# EAGLE design lpcdev (EAGLE 7.5.0)
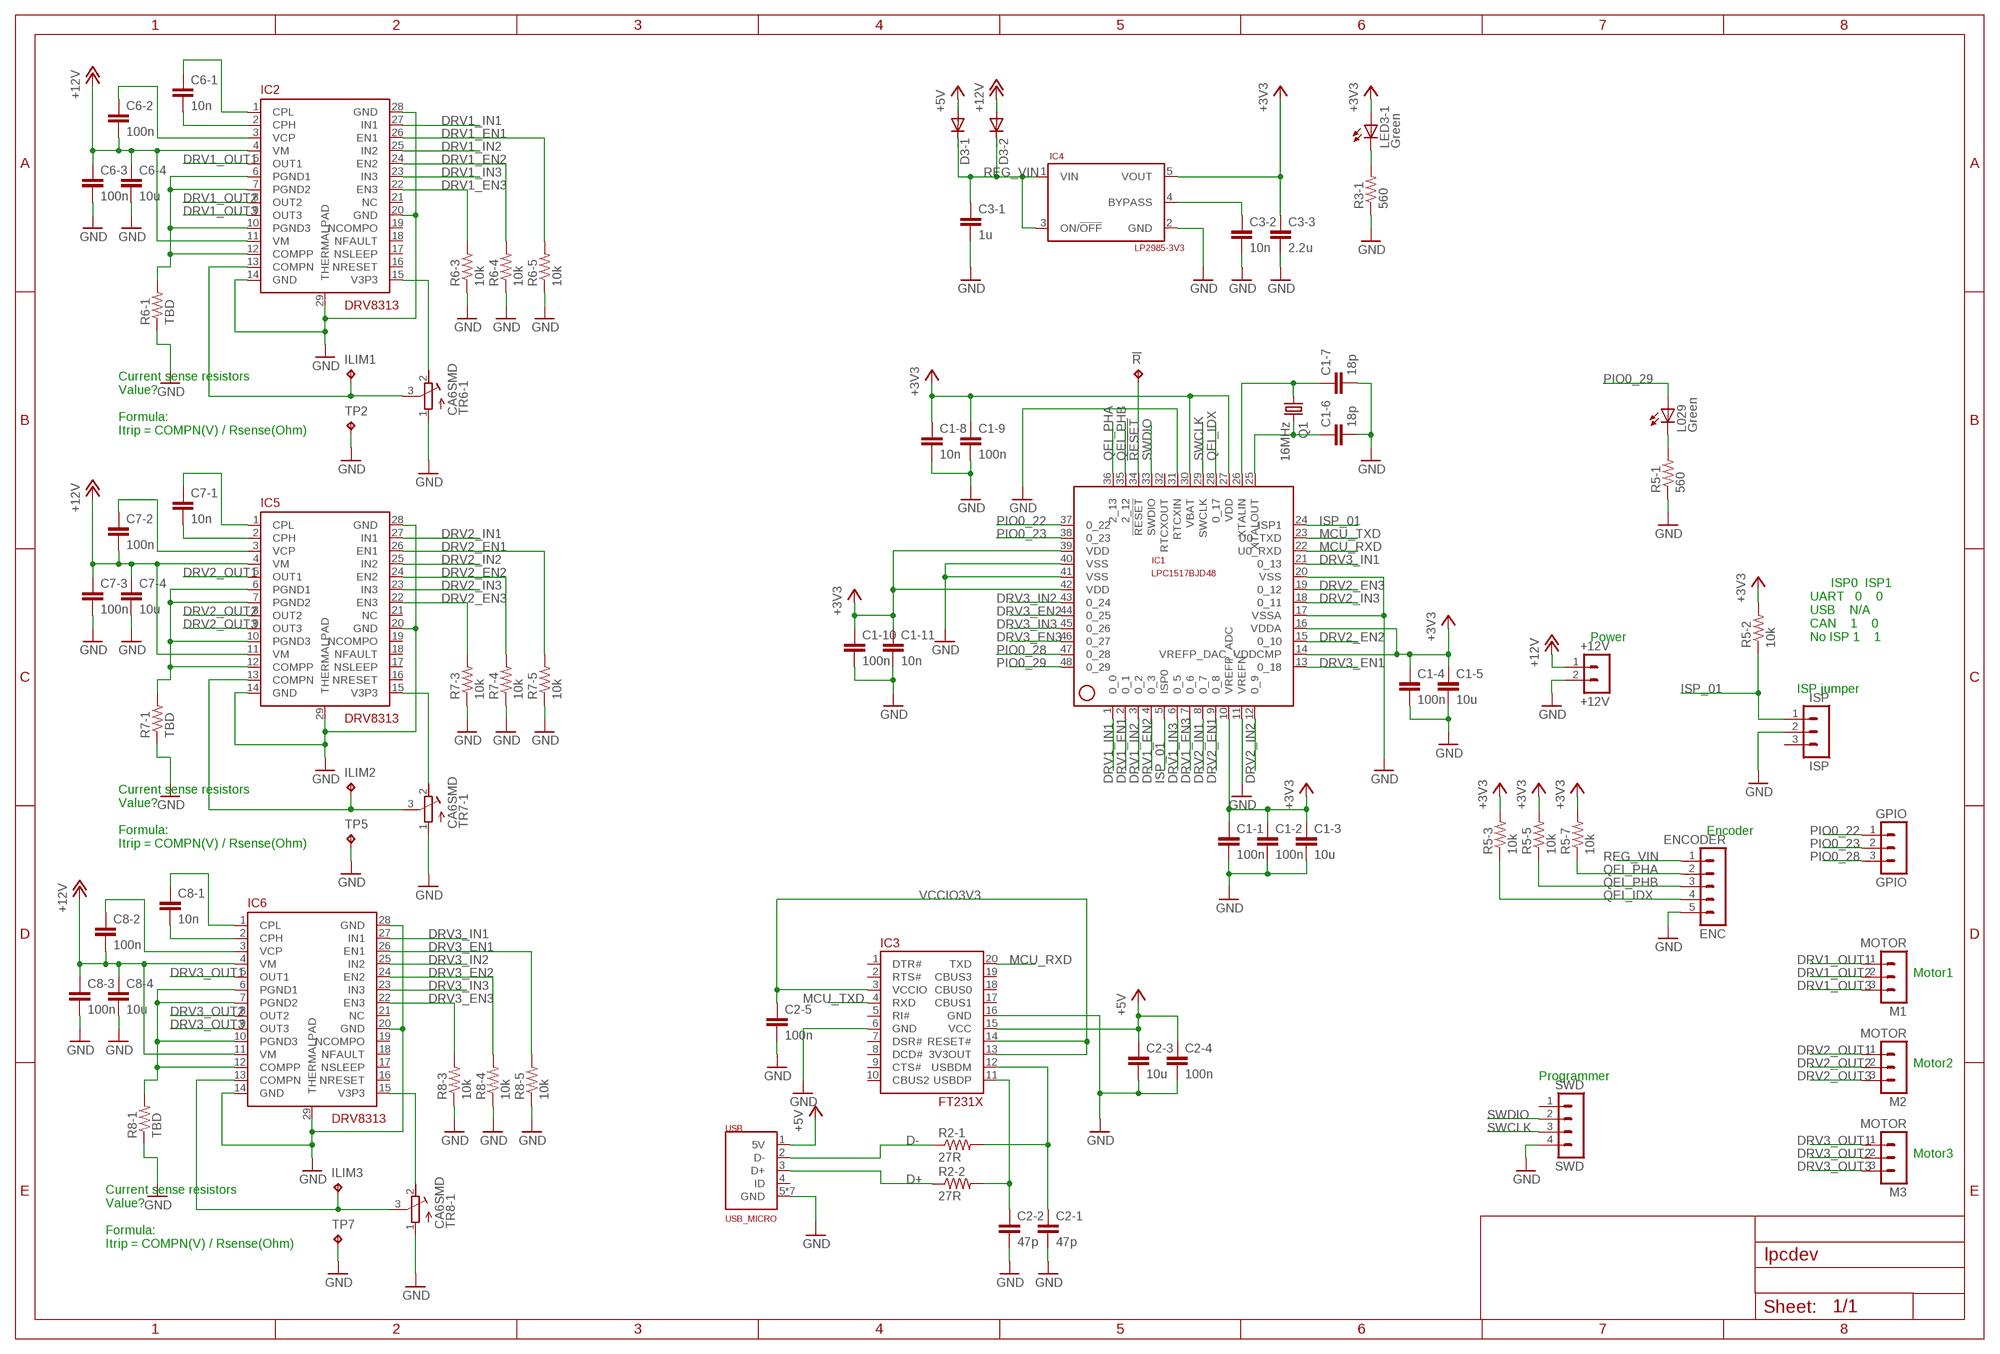
[diagram p0: schematic, sheet 1]

## Parts
!R  TPB1,27  [B1,27]
+12V  +12V  MA02-1  [MA02-1]
C1-1  100n  C-EUC0603  [C0603]
C1-2  100n  C-EUC0603  [C0603]
C1-3  10u  C-EUC0805  [C0805]
C1-4  100n  C-EUC0603  [C0603]
C1-5  10u  C-EUC0805  [C0805]
C1-6  18p  C-EUC0603  [C0603]
C1-7  18p  C-EUC0603  [C0603]
C1-8  10n  C-EUC0603  [C0603]
C1-9  100n  C-EUC0603  [C0603]
C1-10  100n  C-EUC0603  [C0603]
C1-11  10n  C-EUC0603  [C0603]
C2-1  47p  C-EUC0603  [C0603]
C2-2  47p  C-EUC0603  [C0603]
C2-3  10u  C-EUC0805  [C0805]
C2-4  100n  C-EUC0603  [C0603]
C2-5  100n  C-EUC0603  [C0603]
C3-1  1u  C-EUC0805  [C0805]
C3-2  10n  C-EUC0603  [C0603]
C3-3  2.2u  C-EUC0805  [C0805]
C6-1  10n  C-EUC0603  [C0603]
C6-2  100n  C-EUC0603  [C0603]
C6-3  100n  C-EUC0603  [C0603]
C6-4  10u  C-EUC0805  [C0805]
C7-1  10n  C-EUC0603  [C0603]
C7-2  100n  C-EUC0603  [C0603]
C7-3  100n  C-EUC0603  [C0603]
C7-4  10u  C-EUC0805  [C0805]
C8-1  10n  C-EUC0603  [C0603]
C8-2  100n  C-EUC0603  [C0603]
C8-3  100n  C-EUC0603  [C0603]
C8-4  10u  C-EUC0805  [C0805]
D3-1  DIODE-SOD323-R  [SOD323-R]
D3-2  DIODE-SOD323-R  [SOD323-R]
ENC  ENCODER  MA05-1  [MA05-1]
GPIO  GPIO  MA03-1  [MA03-1]
IC1  LPC1517BJD48  [LQFP48]
IC2  DRV8313  [R-PDSO-G28]
IC3  FT231X  [SSOP-20]
IC4  LP2985-3V3  [SOT23]
IC5  DRV8313  [R-PDSO-G28]
IC6  DRV8313  [R-PDSO-G28]
ILIM1  TPB1,27  [B1,27]
ILIM2  TPB1,27  [B1,27]
ILIM3  TPB1,27  [B1,27]
ISP  ISP  MA03-1  [MA03-1]
L029  Green  LEDCHIP-LED0603  [CHIP-LED0603]
LED3-1  Green  LEDCHIP-LED0603  [CHIP-LED0603]
M1  MOTOR  MA03-1  [MA03-1]
M2  MOTOR  MA03-1  [MA03-1]
M3  MOTOR  MA03-1  [MA03-1]
Q1  16MHz  CRYSTALCTS406  [CTS406]
R2-1  27R  R-US_R0603  [R0603]
R2-2  27R  R-US_R0603  [R0603]
R3-1  560  R-US_R0603  [R0603]
R5-1  560  R-US_R0603  [R0603]
R5-2  10k  R-US_R0603  [R0603]
R5-3  10k  R-US_R0603  [R0603]
R5-5  10k  R-US_R0603  [R0603]
R5-7  10k  R-US_R0603  [R0603]
R6-1  TBD  R-US_R0805  [R0805]
R6-3  10k  R-US_R0603  [R0603]
R6-4  10k  R-US_R0603  [R0603]
R6-5  10k  R-US_R0603  [R0603]
R7-1  TBD  R-US_R0805  [R0805]
R7-3  10k  R-US_R0603  [R0603]
R7-4  10k  R-US_R0603  [R0603]
R7-5  10k  R-US_R0603  [R0603]
R8-1  TBD  R-US_R0805  [R0805]
R8-3  10k  R-US_R0603  [R0603]
R8-4  10k  R-US_R0603  [R0603]
R8-5  10k  R-US_R0603  [R0603]
SWD  SWD  MA04-1  [MA04-1]
TP2  TPB1,27  [B1,27]
TP5  TPB1,27  [B1,27]
TP7  TPB1,27  [B1,27]
TR6-1  CA6SMD  [CA6SMD]
TR7-1  CA6SMD  [CA6SMD]
TR8-1  CA6SMD  [CA6SMD]
USB  USB_MICRO  [USB_MICRO]

## Nets
!RESET: !R.TP IC1.34(!RESET)
+3V3: C1-1.1 C1-2.1 C1-3.1 C1-4.1 C1-5.1 C1-8.1 C1-9.1 C1-10.1 C1-11.1 C3-3.1 IC1.10(VREFP_ADC) IC1.14(VREFP_DAC_VDDCMP) IC1.16(VDDA) IC1.27(VDD) IC1.30(VBAT) IC1.39(VDD) IC1.42(VDD) IC4.5(VOUT) LED3-1.A R5-2.2 R5-3.2 R5-5.2 R5-7.2
+5V: C2-3.1 C2-4.1 D3-1.A IC3.15(VCC) USB.1(5V)
+12V: +12V.1 C6-2.2 C6-3.1 C6-4.1 C7-2.2 C7-3.1 C7-4.1 C8-2.2 C8-3.1 C8-4.1 D3-2.A IC2.4(VM) IC2.11(VM) IC5.4(VM) IC5.11(VM) IC6.4(VM) IC6.11(VM)
D+: R2-2.1 USB.3(D+)
D-: R2-1.1 USB.2(D-)
DRV1_3V3: IC2.15(V3P3) TR6-1.2(E)
DRV1_COMPN: IC2.13(COMPN) ILIM1.TP TR6-1.3(S)
DRV1_COMPP: IC2.6(PGND1) IC2.7(PGND2) IC2.10(PGND3) IC2.12(COMPP) R6-1.2
DRV1_CPH: C6-1.2 IC2.2(CPH)
DRV1_CPL: C6-1.1 IC2.1(CPL)
DRV1_EN1: IC1.2(0_1) IC2.26(EN1) R6-5.2
DRV1_EN2: IC1.4(0_3) IC2.24(EN2) R6-4.2
DRV1_EN3: IC1.7(0_6) IC2.22(EN3) R6-3.2
DRV1_IN1: IC1.1(0_0) IC2.27(IN1)
DRV1_IN2: IC1.3(0_2) IC2.25(IN2)
DRV1_IN3: IC1.6(0_5) IC2.23(IN3)
DRV1_OUT1: IC2.5(OUT1) M1.1
DRV1_OUT2: IC2.8(OUT2) M1.2
DRV1_OUT3: IC2.9(OUT3) M1.3
DRV1_VCP: C6-2.1 IC2.3(VCP)
DRV2_3V1: IC5.15(V3P3) TR7-1.2(E)
DRV2_COMPN1: IC5.13(COMPN) ILIM2.TP TR7-1.3(S)
DRV2_COMPP1: IC5.6(PGND1) IC5.7(PGND2) IC5.10(PGND3) IC5.12(COMPP) R7-1.2
DRV2_CPH1: C7-1.2 IC5.2(CPH)
DRV2_CPL1: C7-1.1 IC5.1(CPL)
DRV2_EN1: IC1.9(0_8) IC5.26(EN1) R7-5.2
DRV2_EN2: IC1.15(0_10) IC5.24(EN2) R7-4.2
DRV2_EN3: IC1.19(0_12) IC5.22(EN3) R7-3.2
DRV2_IN1: IC1.8(0_7) IC5.27(IN1)
DRV2_IN2: IC1.12(0_9) IC5.25(IN2)
DRV2_IN3: IC1.18(0_11) IC5.23(IN3)
DRV2_OUT1: IC5.5(OUT1) M2.1
DRV2_OUT2: IC5.8(OUT2) M2.2
DRV2_OUT3: IC5.9(OUT3) M2.3
DRV2_VCP1: C7-2.1 IC5.3(VCP)
DRV3_3V2: IC6.15(V3P3) TR8-1.2(E)
DRV3_COMPN2: IC6.13(COMPN) ILIM3.TP TR8-1.3(S)
DRV3_COMPP2: IC6.6(PGND1) IC6.7(PGND2) IC6.10(PGND3) IC6.12(COMPP) R8-1.2
DRV3_CPH2: C8-1.2 IC6.2(CPH)
DRV3_CPL2: C8-1.1 IC6.1(CPL)
DRV3_EN1: IC1.13(0_18) IC6.26(EN1) R8-5.2
DRV3_EN2: IC1.44(0_25) IC6.24(EN2) R8-4.2
DRV3_EN3: IC1.46(0_27) IC6.22(EN3) R8-3.2
DRV3_IN1: IC1.21(0_13) IC6.27(IN1)
DRV3_IN2: IC1.43(0_24) IC6.25(IN2)
DRV3_IN3: IC1.45(0_26) IC6.23(IN3)
DRV3_OUT1: IC6.5(OUT1) M3.1
DRV3_OUT2: IC6.8(OUT2) M3.2
DRV3_OUT3: IC6.9(OUT3) M3.3
DRV3_VCP2: C8-2.1 IC6.3(VCP)
GND: +12V.2 C1-1.2 C1-2.2 C1-3.2 C1-4.2 C1-5.2 C1-6.2 C1-7.2 C1-8.2 C1-9.2 C1-10.2 C1-11.2 C2-1.2 C2-2.2 C2-3.2 C2-4.2 C2-5.2 C3-1.2 C3-2.2 C3-3.2 C6-3.2 C6-4.2 C7-3.2 C7-4.2 C8-3.2 C8-4.2 ENC.5 IC1.11(VREFN) IC1.17(VSSA) IC1.20(VSS) IC1.31(RTCXIN) IC1.40(VSS) IC1.41(VSS) IC2.14(GND) IC2.20(GND) IC2.28(GND) IC2.29(THERMALPAD) IC3.6(GND) IC3.16(GND) IC4.2(GND) IC5.14(GND) IC5.20(GND) IC5.28(GND) IC5.29(THERMALPAD) IC6.14(GND) IC6.20(GND) IC6.28(GND) IC6.29(THERMALPAD) ISP.2 R3-1.1 R5-1.1 R6-1.1 R6-3.1 R6-4.1 R6-5.1 R7-1.1 R7-3.1 R7-4.1 R7-5.1 R8-1.1 R8-3.1 R8-4.1 R8-5.1 SWD.4 TP2.TP TP5.TP TP7.TP TR6-1.1(A) TR7-1.1(A) TR8-1.1(A) USB.5(GND) USB.H1(GND) USB.H2(GND) USB.S1(GND) USB.S2(GND) USB.S3(GND) USB.S4(GND)
ISP_01: IC1.5(ISP0) IC1.24(ISP1) ISP.1 R5-2.1
LED1: L029.C R5-1.2
LED2: LED3-1.C R3-1.2
MCU_RXD: IC1.22(U0_RXD) IC3.20(TXD)
MCU_TXD: IC1.23(U0_TXD) IC3.4(RXD)
PIO0_22: GPIO.1 IC1.37(0_22)
PIO0_23: GPIO.2 IC1.38(0_23)
PIO0_28: GPIO.3 IC1.47(0_28)
PIO0_29: IC1.48(0_29) L029.A
QEI_IDX: ENC.4 IC1.28(0_17) R5-3.1
QEI_PHA: ENC.2 IC1.36(2_13) R5-7.1
QEI_PHB: ENC.3 IC1.35(2_12) R5-5.1
REG_BYPASS: C3-2.1 IC4.4(BYPASS)
REG_VIN: C3-1.1 D3-1.C D3-2.C ENC.1 IC4.1(VIN) IC4.3(ON/!OFF)
SWCLK: IC1.29(SWCLK) SWD.3
SWDIO: IC1.33(SWDIO) SWD.2
USBDM: C2-1.1 IC3.12(USBDM) R2-1.2
USBDP: C2-2.1 IC3.11(USBDP) R2-2.2
VCCIO3V3: C2-5.1 IC3.3(VCCIO) IC3.13(3V3OUT) IC3.14(RESET#)
XTALIN: C1-7.1 IC1.26(XTALIN) Q1.1
XTALOUT: C1-6.1 IC1.25(XTALOUT) Q1.3
Unconnected: IC1.32(RTCXOUT) IC2.16(NRESET) IC2.17(NSLEEP) IC2.18(NFAULT) IC2.19(NCOMPO) IC2.21(NC) IC3.1(DTR#) IC3.2(RTS#) IC3.5(RI#) IC3.7(DSR#) IC3.8(DCD#) IC3.9(CTS#) IC3.10(CBUS2) IC3.17(CBUS1) IC3.18(CBUS0) IC3.19(CBUS3) IC5.16(NRESET) IC5.17(NSLEEP) IC5.18(NFAULT) IC5.19(NCOMPO) IC5.21(NC) IC6.16(NRESET) IC6.17(NSLEEP) IC6.18(NFAULT) IC6.19(NCOMPO) IC6.21(NC) ISP.3 SWD.1 USB.4(ID)

## Notes on the sheet
- Current sense resistors
  Value?
  
  Formula:
  Itrip = COMPN(V) / Rsense(Ohm)
- Power
- ISP0  ISP1
  UART   0    0
  USB    N/A
  CAN    1    0
  No ISP 1    1
- ISP jumper
- Encoder
- Current sense resistors
  Value?
  
  Formula:
  Itrip = COMPN(V) / Rsense(Ohm)
- Motor1
- Motor2
- Programmer
- Motor3
- Current sense resistors
  Value?
  
  Formula:
  Itrip = COMPN(V) / Rsense(Ohm)

## Library data of the parts
!R ILIM1-ILIM3 TP2 TP5 TP7 = testpad:TP: Test pad
+12V = lpclib:MA02-1: PIN HEADER; OC_FARNELL: unknown; OC_NEWARK: unknown
C1-1-C1-11 C2-1-C2-5 C3-1-C3-3 C6-1-C6-4 C7-1-C7-4 C8-1-C8-4 = rcl:C-EU: CAPACITOR, European symbol
D3-1 D3-2 = diode:DIODE-: DIODE
ENC = lpclib:MA05-1: PIN HEADER; OC_FARNELL: unknown; OC_NEWARK: unknown
GPIO ISP M1-M3 = lpclib:MA03-1: PIN HEADER; OC_FARNELL: unknown; OC_NEWARK: unknown
IC1 = lpclib:LPC1517BJD48: LPC1517BJD48 First try at a LPC1517 chip for use in a motor driver Datasheet <http://www.nxp.com/documents/data_sheet/LPC15XX.pdf> User manual <http://www.nxp.com/documents/user_manual/UM10736.pdf>
IC2 IC5 IC6 = lpclib:DRV8313: DRV8313 Datasheet <http://www.ti.com/lit/ds/symlink/drv8313.pdf>
IC3 = lpclib:FT231X: FT231X Datasheet <http://www.ftdichip.com/Support/Documents/DataSheets/ICs/DS_FT231X.pdf>
IC4 = lpclib:LP2985-3V3: LP2985 3.3V regulator Datasheet <http://www.electrokit.com/productFile/download/940>
L029 LED3-1 = led:LED: LED OSRAM: - CHIPLED LG R971, LG N971, LY N971, LG Q971, LY Q971, LO R971, LY R971 LH N974, LH R974 LS Q976, LO Q976, LY Q976 LO Q996 - Hyper CHIPLED LW Q18S LB Q993, LB Q99A, LB R99A - SideLED LS A670, LO A670, LY A670, LG A670, LP A670 LB A673, LV A673, LT A673, LW A673 LH A674 LY A675 LS A676, LA A676, LO A676, LY A676, LW A676 LS A679, LY A679, LG A679 - Hyper Micro SIDELED® LS Y876, LA Y876, LO Y876, LY Y876 LT Y87S - SmartLED LW L88C, LW L88S LB L89C, LB L89S, LG L890 LS L89K, LO L89K, LY L89K LS L896, LA L896, LO L896, LY L896 - TOPLED LS T670, LO T670, LY T670, LG T670, LP T670 LSG T670, LSP T670, LSY T670, LOP T670, LYG T670 LG T671, LOG T671, LSG T671 LB T673, LV T673, LT T673, LW T673 LH T674 LS T676, LA T676, LO T676, LY T676, LB T676, LH T676, LSB T676, LW T676 LB T67C, LV T67C, LT T67C, LS T67K, LO T67K, LY T67K, LW E67C LS E67B, LA E67B, LO E67B, LY E67B, LB E67C, LV E67C, LT E67C LW T67C LS T679, LY T679, LG T679 LS T770, LO T770, LY T770, LG T770, LP T770 LB T773, LV T773, LT T773, LW T773 LH T774 LS E675, LA E675, LY E675, LS T675 LS T776, LA T776, LO T776, LY T776, LB T776 LHGB T686 LT T68C, LB T68C - Hyper Mini TOPLED® LB M676 - Mini TOPLED Santana® LG M470 LS M47K, LO M47K, LY M47K Source: http://www.osram.convergy.de LUXEON: - LUMILED® LXK2-PW12-R00, LXK2-PW12-S00, LXK2-PW14-U00, LXK2-PW14-V00 LXK2-PM12-R00, LXK2-PM12-S00, LXK2-PM14-U00 LXK2-PE12-Q00, LXK2-PE12-R00, LXK2-PE12-S00, LXK2-PE14-T00, LXK2-PE14-U00 LXK2-PB12-K00, LXK2-PB12-L00, LXK2-PB12-M00, LXK2-PB14-N00, LXK2-PB14-P00, LXK2-PB14-Q00 LXK2-PR12-L00, LXK2-PR12-M00, LXK2-PR14-Q00, LXK2-PR14-R00 LXK2-PD12-Q00, LXK2-PD12-R00, LXK2-PD12-S00 LXK2-PH12-R00, LXK2-PH12-S00 LXK2-PL12-P00, LXK2-PL12-Q00, LXK2-PL12-R00 Source: www.luxeon.com KINGBRIGHT: KA-3528ASYC Source: www.kingbright.com
Q1 = crystal:CRYSTAL: CRYSTAL; OC_FARNELL: unknown; OC_NEWARK: unknown
R2-1 R2-2 R3-1 R5-1-R5-3 R5-5 R5-7 R6-1 R6-3-R6-5 R7-1 R7-3-R7-5 R8-1 R8-3-R8-5 = rcl:R-US_: RESISTOR, American symbol
SWD = lpclib:MA04-1: PIN HEADER; OC_FARNELL: unknown; OC_NEWARK: unknown
TR6-1 TR7-1 TR8-1 = lpclib:CA6SMD: Electrokit <http://www.electrokit.com/trimpot-ca6smd-10-kohm.51062>
USB = lpclib:USB_MICRO: Electrokit <http://www.electrokit.com/usb-microb-kontakt-smd.50116>

## Board
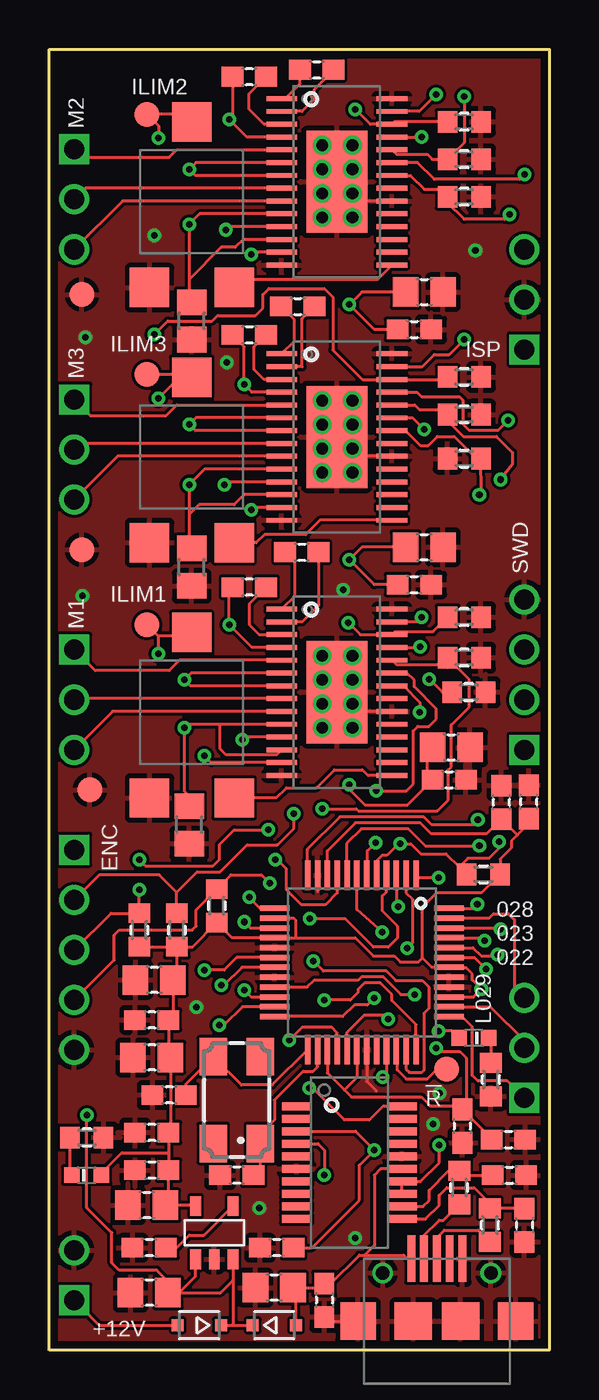
[diagram p1: board, top side]
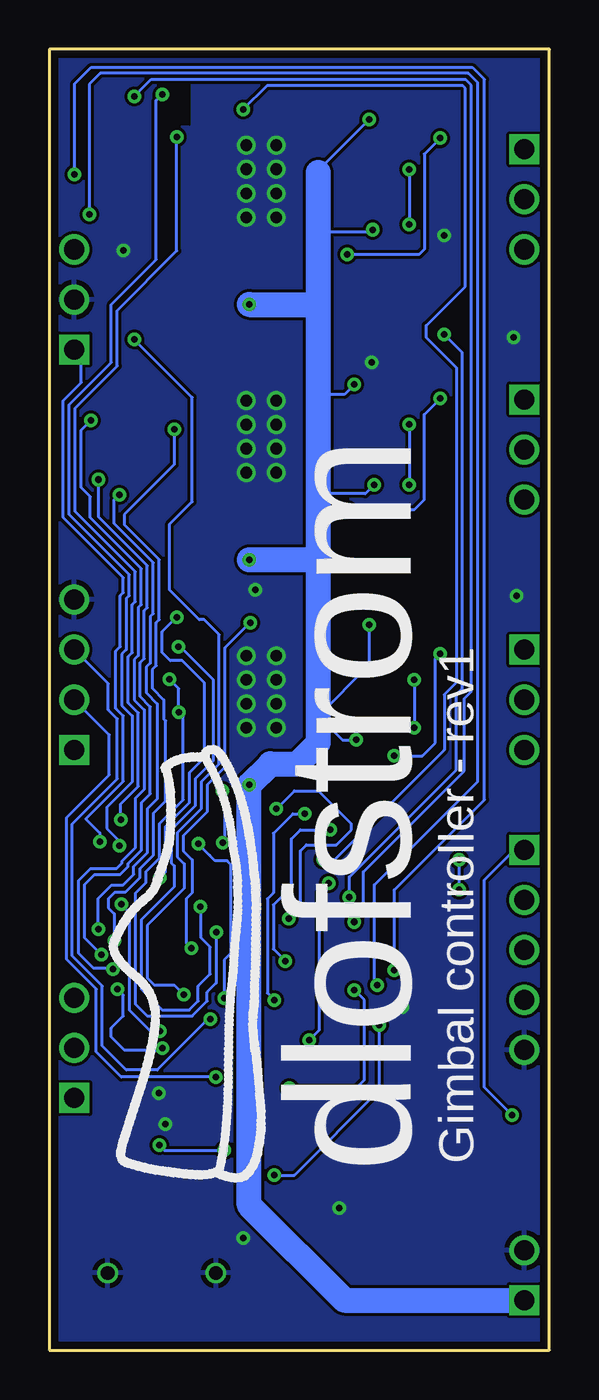
[diagram p2: board, bottom side, seen from below]

Size 25.4 x 66.04 mm. Coordinates in mm from the lower left corner, seen from the top.
Outline: 0,66.04 25.4,66.04 25.4,0 0,0 0,66.04
Copper layers (1*16): Top 0.0356mm / dielectric 1.5011mm / Bottom 0.0356mm
Design rules "oshpark-2layer *": minimum track width 6mil, minimum drill 13mil, track to track 6mil, track to pad 6mil, pad to pad 6mil, via to via 6mil, smd to smd 6mil, copper to edge 15mil, drill to drill 6mil, minimum pad ring 7mil, minimum via ring 7mil, stop-mask expansion 2.5mil, vias tented up to drill 13mil, thermal gap 10mil
bRestrict: area 18.3,62.2 to 18.7,64.2

### Footprints (pad centres in the part's own frame; a part is rotated, then mirrored left to right if it is on the bottom)
B1,27 = smd 1.27 x 1.27: TP 0,0
MA02-1 = drill 1.016 square: 1 -2.54,0 | drill 1.016: 2 0,0
C0603 = smd 1.1 x 1: 1 -0.85,0; 2 0.85,0
C0805 = smd 1.3 x 1.5: 1 -0.95,0; 2 0.95,0
SOD323-R = smd 0.6 x 0.6: A 1.1,0; C -1.1,0
MA05-1 = drill 1.016 square: 1 -5.08,0 | drill 1.016: 2 -2.54,0; 3 0,0; 4 2.54,0; 5 5.08,0
MA03-1 = drill 1.016 square: 1 -2.54,0 | drill 1.016: 2 0,0; 3 2.54,0
LQFP48 = smd 0.28 x 1.5: 1 -2.75,-4.425; 2 -2.25,-4.425; 3 -1.75,-4.425; 4 -1.25,-4.425; 5 -0.75,-4.425; 6 -0.25,-4.425; 7 0.25,-4.425; 8 0.75,-4.425; 9 1.25,-4.425; 10 1.75,-4.425; 11 2.25,-4.425; 12 2.75,-4.425; 25 2.75,4.425; 26 2.25,4.425; 27 1.75,4.425; 28 1.25,4.425; 29 0.75,4.425; 30 0.25,4.425; 31 -0.25,4.425; 32 -0.75,4.425; 33 -1.25,4.425; 34 -1.75,4.425; 35 -2.25,4.425; 36 -2.75,4.425 | smd 1.5 x 0.28: 13 4.425,-2.75; 14 4.425,-2.25; 15 4.425,-1.75; 16 4.425,-1.25; 17 4.425,-0.75; 18 4.425,-0.25; 19 4.425,0.25; 20 4.425,0.75; 21 4.425,1.25; 22 4.425,1.75; 23 4.425,2.25; 24 4.425,2.75; 37 -4.425,2.75; 38 -4.425,2.25; 39 -4.425,1.75; 40 -4.425,1.25; 41 -4.425,0.75; 42 -4.425,0.25; 43 -4.425,-0.25; 44 -4.425,-0.75; 45 -4.425,-1.25; 46 -4.425,-1.75; 47 -4.425,-2.25; 48 -4.425,-2.75
R-PDSO-G28 = smd 0.25 x 1.55: 1 -4.225,-2.8; 2 -3.575,-2.8; 3 -2.925,-2.8; 4 -2.275,-2.8; 5 -1.625,-2.8; 6 -0.975,-2.8; 7 -0.325,-2.8; 8 0.325,-2.8; 9 0.975,-2.8; 10 1.625,-2.8; 11 2.275,-2.8; 12 2.925,-2.8; 13 3.575,-2.8; 14 4.225,-2.8; 15 4.225,2.8; 16 3.575,2.8; 17 2.925,2.8; 18 2.275,2.8; 19 1.625,2.8; 20 0.975,2.8; 21 0.325,2.8; 22 -0.325,2.8; 23 -0.975,2.8; 24 -1.625,2.8; 25 -2.275,2.8; 26 -2.925,2.8; 27 -3.575,2.8; 28 -4.225,2.8 | smd 5.18 x 3.1: 29 0,0
SSOP-20 = smd 0.4 x 1.5: 1 -2.857,-2.68; 2 -2.223,-2.68; 3 -1.587,-2.68; 4 -0.953,-2.68; 5 -0.318,-2.68; 6 0.318,-2.68; 7 0.953,-2.68; 8 1.587,-2.68; 9 2.223,-2.68; 10 2.857,-2.68; 11 2.857,2.68; 12 2.223,2.68; 13 1.587,2.68; 14 0.953,2.68; 15 0.318,2.68; 16 -0.318,2.68; 17 -0.953,2.68; 18 -1.587,2.68; 19 -2.223,2.68; 20 -2.857,2.68
SOT23 = smd 0.55 x 1: 1 -0.95,-1.35; 2 0,-1.35; 3 0.95,-1.35; 4 0.95,1.35; 5 -0.95,1.35
CHIP-LED0603 = smd 0.8 x 0.8: A 0,-0.75; C 0,0.75
CTS406 = smd 1.9 x 1.4: 1 -2.2,-1.2; 2 2.2,-1.2; 3 2.2,1.2; 4 -2.2,1.2
R0603 = smd 1 x 1.1: 1 -0.85,0; 2 0.85,0
R0805 = smd 1.3 x 1.5: 1 -0.95,0; 2 0.95,0
MA04-1 = drill 1.016 square: 1 -3.81,0 | drill 1.016: 2 -1.27,0; 3 1.27,0; 4 3.81,0
CA6SMD = smd 2 x 2: 1 -2.15,-4.35; 2 2.15,-4.35; 3 0,4.05
USB_MICRO = smd 0.4 x 2.35: 1 -1.3,3.175; 2 -0.65,3.175; 3 0,3.175; 4 0.65,3.175; 5 1.3,3.175 | drill 0.7: H1 -2.75,2.45; H2 2.75,2.45 | smd 1.8 x 1.9: S1 -4,0; S4 4,0 | smd 1.9 x 1.9: S2 -1.2,0; S3 1.2,0

### Placement (x,y rotation side)
!R  20.19,14.27 0 top
+12V  1.27,5.08 90 top
C1-1  22.96,27.81 90 top
C1-2  24.36,27.84 90 top
C1-3  5.33,18.8 180 top
C1-4  5.21,16.76 180 top
C1-5  5.21,14.86 180 top
C1-6  6.1,12.95 180 top
C1-7  9.53,8.89 180 top
C1-8  5.21,11.05 180 top
C1-9  5.21,9.14 180 top
C1-10  20.98,11.38 270 top
C1-11  23.32,10.69 0 top
C2-1  23.37,8.89 0 top
C2-2  24.13,6.35 270 top
C2-3  11.43,3.18 180 top
C2-4  13.97,2.54 270 top
C2-5  11.56,5.21 180 top
C3-1  5.08,2.92 180 top
C3-2  5.08,5.21 180 top
C3-3  4.95,7.37 180 top
C6-1  12.83,40.51 0 top
C6-2  10.16,38.73 180 top
C6-3  20.32,28.96 0 top
C6-4  20.42,30.61 0 top
C7-1  13.59,65 0 top
C7-2  10.16,64.64 180 top
C7-3  18.54,51.82 0 top
C7-4  19.05,53.72 0 top
C8-1  12.62,52.98 0 top
C8-2  10.16,51.54 180 top
C8-3  18.54,38.86 0 top
C8-4  19.05,40.77 0 top
D3-1  11.43,1.27 0 top
D3-2  7.62,1.27 180 top
ENC  1.27,20.32 270 top
GPIO  24.13,15.34 90 top
IC1  15.88,19.68 180 top
IC2  14.61,33.4 270 top
IC3  15.24,9.53 270 top
IC4  8.38,5.97 0 top
IC5  14.61,59.31 270 top
IC6  14.61,46.36 270 top
ILIM1  4.95,36.83 0 top
ILIM2  4.95,62.74 0 top
ILIM3  4.95,49.53 0 top
ISP  24.13,53.34 90 top
L029  21.56,15.85 270 top
LED3-1  1.91,8.89 90 top
M1  1.27,33.02 270 top
M2  1.27,58.42 270 top
M3  1.27,45.72 270 top
Q1  9.53,12.7 90 top
R2-1  20.83,8.26 90 top
R2-2  22.38,6.35 90 top
R3-1  1.91,10.79 180 top
R5-1  22.43,13.74 90 top
R5-2  22.05,24.16 0 top
R5-3  8.51,22.56 270 top
R5-5  4.57,21.34 270 top
R5-7  6.48,21.34 270 top
R6-1  7.11,26.67 90 top
R6-3  21.31,33.4 180 top
R6-4  21.08,35.15 180 top
R6-5  21.08,37.21 180 top
R7-1  7.24,52.25 90 top
R7-3  21.08,58.55 180 top
R7-4  21.08,60.45 180 top
R7-5  21.08,62.36 180 top
R8-1  7.24,39.75 90 top
R8-3  21.08,45.26 0 top
R8-4  21.08,47.5 180 top
R8-5  21.08,49.4 180 top
SWD  24.13,34.29 90 top
TP2  2.06,28.45 0 top
TP5  1.65,40.64 0 top
TP7  1.65,53.59 0 top
TR6-1  7.24,32.39 0 top
TR7-1  7.24,58.29 0 top
TR8-1  7.24,45.34 0 top
USB  19.68,1.47 0 top

### Tracks (layer width: path | path; a pad name or v marks a point on that pad's centre or on a via)
!RESET
  Top 0.152: IC1.34 17.68,15.21 17.68,14.22 18.14,13.77 19.2,13.77 19.71,14.27 !R.TP
+3V3  (via drill 0.33)
  Top 0.152: R5-5.2 R5-7.2 | R5-7.2 6.48,18.99 C1-3.1 6.28,16.99 C1-4.1 6.06,14.96 C1-5.1 6.16,11.15 C1-8.1 6.06,10.03 | 6.06,10.03 C1-9.1 6.06,7.52 C3-3.1 7.38,7.37 IC4.5 | LED3-1.A 2.65,9 3.68,10.03 6.06,10.03 | IC1.27 14.12,14.07 14.99,13.21 | 14.99,13.21 15.34,12.85 18.9,12.85 19.36,12.39 20.81,12.39 C1-10.1 | IC1.14 12.41,21.93 12.5,21.84 12.5,20.93 | 12.5,20.93 IC1.16 9.28,20.93 R5-3.2 7.29,20.49 R5-7.2 | IC1.10 14.12,25.35 15.54,26.77 18.85,26.77 19.41,26.21 22.21,26.21 C1-1.1 | 23.07,26.62 C1-1.1 | IC1.30 15.62,13.85 14.99,13.21 | 18.95,19.91 19.43,19.43 IC1.42 20.85,19.43 20.88,19.41 21.18,19.41 21.49,19.1 21.49,18.8 v21.95,18.34 21.54,17.93 IC1.39 | 12.5,20.93 15.54,20.93 16.46,20.01 17.53,20.01 17.83,19.71 18.75,19.71 18.95,19.91 | C1-2.1 24.34,26.55 24.18,26.55 23.77,26.15 | 23.77,26.15 C1-1.1 | 23.77,26.15 23.47,25.85 23.47,25.5 22.9,24.93 R5-2.2 21.96,23.22 19.66,23.22 18.95,22.5 18.95,19.91 | C1-10.1 22.47,10.74 C1-11.1 | C1-10.1 21.18,12.43 21.18,14.83 20.85,15.16 19.84,15.16 v19.66,15.34
  Bottom 0.152: v21.95,18.34 21.64,18.03 21.64,16.97 22.25,16.36 22.25,15.9 21.59,15.24 19.76,15.24 v19.66,15.34
+5V
  Top 0.152: D3-1.A 12.53,3.02 C2-3.1 13.76,3.17 C2-4.1 14.31,3.39 15.75,4.83 16,4.83 | 16,4.83 18,4.83 18.18,4.65 USB.1 | IC3.15 16.83,9.21 16.51,8.89 16.51,5.33 16,4.83
+12V  (via drill 0.33, 0.33 pad 0.33)
  Top 0.152: +12V.1 2.54,1.27 D3-2.A | IC6.4 10.3,48.63 v9.91,49.02 9.91,50.94 C8-2.2 9.31,51.4 | IC6.11 9.03,44.08 v8.89,43.94 | IC2.4 10.3,35.68 v9.14,36.83 9.14,38.57 C6-2.2 | IC5.4 10.04,61.58 v9.14,62.48 9.31,62.65 C7-2.2 | C7-4.1 15.88,53.72 v15.24,53.09 16.51,51.82 C7-3.1 | C8-4.1 15.88,40.77 v15.24,40.13 16.51,38.86 C8-3.1 | v15.24,28.7 15.24,28.47 16.03,27.69 18.2,27.69 C6-3.1 19.22,29.21 19.22,30.35 C6-4.1 | IC2.11 9.94,31.13 v9.8,30.99 | IC5.11 9.13,57.03 v8.98,56.88
  Bottom 0.152: v9.8,30.99 10.52,30.99 11.73,32.21 9.14,34.8 v9.14,36.83 | v8.89,43.94 9.35,43.48 11.73,43.48 | 11.91,53.09 arc90 11.73,52.91 | v9.91,49.02 10.41,48.51 11.73,48.51 | 11.73,56.74 9.12,56.74 v8.98,56.88 | 11.73,59.79 11.73,59.89 v9.14,62.48
  Bottom 1.27: +12V.1 10.41,2.54 15.24,7.37 v15.24,28.7 14.17,29.77 12.8,29.77 11.73,30.84 11.73,32.21 11.73,32.82 11.73,40.13 | 11.73,40.13 11.73,43.48 11.73,48.51 11.73,52.91 11.73,56.74 11.73,59.79 | v15.24,40.13 11.73,40.13 | v15.24,53.09 11.91,53.09
D+
  Top 0.152: USB.3 19.68,5.71 20.07,6.1 21.78,6.1 R2-2.1
D-
  Top 0.152: R2-1.1 20.03,6.6 19.81,6.6 19.04,5.83 USB.2
DRV1_3V3
  Top 0.152: TR6-1.2 11.53,28.03 12.04,28.55 13.56,28.55 14.48,29.46 15.9,29.46 16.19,29.18 IC2.15
DRV1_COMPN  (via drill 0.33 pad 0.33)
  Top 0.152: ILIM1.TP 5.54,36.25 | 5.54,36.25 v5.54,35.36 | TR6-1.3 7.05,36.25 5.54,36.25 | IC2.13 8.22,29.83 v7.87,30.17
  Bottom 0.152: v7.87,30.17 6.45,30.17 5.79,30.84 5.79,35.1 v5.54,35.36
DRV1_COMPP  (via drill 0.33 pad 0.33)
  Top 0.152: IC2.6 7.2,34.38 v6.86,34.04 7.17,33.73 IC2.7 | IC2.10 8.69,31.78 | 8.69,31.78 7.04,31.78 v6.86,31.6 6.86,28.38 7.11,28.13 R6-1.2 | IC2.12 11.55,30.23 8.99,30.23 8.69,30.53 8.69,31.78
  Bottom 0.152: v6.86,34.04 v6.86,31.6
DRV1_CPH
  Top 0.152: C6-1.2 13.68,37.81 12.85,36.98 IC2.2
DRV1_CPL
  Top 0.152: C6-1.1 12.45,40.04 12.45,38.27 IC2.1
DRV1_EN1  (via drill 0.33 pad 0.33)
  Top 0.152: IC1.2 18.12,23.23 18.44,22.91 18.44,20.68 v18.19,20.42 | v15.19,36.93 15.79,36.33 IC2.26 17.55,36.47 19.5,36.47 R6-5.2
  Bottom 0.152: v15.19,36.93 16.46,35.66 16.46,29.62 17.37,28.7 17.37,27.33 18.59,26.11 18.59,25.35 18.14,24.89 18.14,23.22 18.44,22.91 18.44,20.68 v18.19,20.42
DRV1_EN2  (via drill 0.33 pad 0.33)
  Top 0.152: IC1.4 17.12,23.27 16.92,23.06 16.92,22.3 17.68,21.54 17.68,20.93 17.22,20.47 16.46,20.47 15.04,21.9 v13.23,21.9 | v13.87,27.48 15.6,27.48 15.7,27.38 19.71,27.38 20.27,27.94 20.27,29.46 20.42,29.62 20.42,31.75 21.34,32.66 21.34,34.04 20.23,35.14 R6-4.2 | IC2.24 17.63,34.8 19.88,34.8 R6-4.2 | 20.57,34.81 R6-4.2 | 20.23,34.63 R6-4.2
  Bottom 0.152: v13.87,27.48 12.95,28.4 11.73,28.4 10.06,26.72 10.06,26.42 10.82,25.65 12.34,25.65 12.65,25.35 12.65,22.4 13.15,21.9 v13.23,21.9
DRV1_EN3  (via drill 0.33 pad 0.15, 0.33 pad 0.33)
  Top 0.152: IC1.7 15.62,22.37 v16.92,21.23 | IC2.22 17.98,33.73 18.82,32.89 v18.82,32.38 | v19.3,34.06 19.96,33.4 R6-3.2
  Bottom 0.152: v16.92,21.23 16.92,18.64 17.37,18.19 17.37,17.73 18.14,16.97 20.42,16.97 21.03,17.58 21.03,23.19 20.5,23.72 20.5,24.28 19.81,24.97 19.81,26.72 18.59,27.94 18.59,32.16 v18.82,32.38 18.82,33.58 v19.3,34.06
DRV1_IN1  (via drill 0.33 pad 0.33)
  Top 0.152: 18.64,24.13 IC1.1 18.76,23.98 v19.79,23.98 | v18.92,37.21 18.69,36.98 IC2.27
  Bottom 0.152: v18.92,37.21 19.66,36.47 19.66,35.41 19.25,35 18.64,35 17.53,33.88 17.53,30.07 18.29,29.31 18.29,27.79 19.51,26.57 19.51,24.26 v19.79,23.98
DRV1_IN2  (via drill 0.33 pad 0.33)
  Top 0.152: IC2.25 18.81,35.68 v18.85,35.71 | IC1.3 17.62,22.61 v17.73,22.5
  Bottom 0.152: v18.85,35.71 18.75,35.71 17.07,34.04 17.07,29.92 17.98,29.01 17.98,27.63 19.2,26.42 19.2,24.74 19.05,24.59 19.05,23.52 20.73,21.84 20.73,18.34 19.66,17.27 18.29,17.27 17.83,17.73 17.83,18.49 17.22,19.1 17.22,20.47 17.68,20.93 17.68,22.45 v17.73,22.5
DRV1_IN3  (via drill 0.33 pad 0.33)
  Top 0.152: IC1.6 16.15,24.14 16.15,25.35 16.56,25.76 v16.59,25.76 | v16.61,28.4 18.14,28.4 18.49,28.75 18.49,31.44 18.72,31.67 19.28,31.67 19.66,32.05 19.66,32.56 18.54,33.68 18.54,34.01 18.18,34.38 IC2.23
  Bottom 0.152: v16.61,28.4 16.46,28.24 16.46,25.96 16.59,25.83 v16.59,25.76
DRV1_OUT1
  Top 0.152: M1.1 2.34,34.49 6.1,34.49 6.63,35.03 IC2.5
DRV1_OUT2
  Top 0.152: IC2.8 1.33,33.08 M1.2
DRV1_OUT3
  Top 0.152: IC2.9 3.22,32.43 M1.3
DRV1_VCP
  Top 0.152: C6-2.1 10.16,37.88 10.16,36.83 10.66,36.33 IC2.3
DRV2_3V1
  Top 0.152: IC5.15 16.68,54.36 9.8,54.36 TR7-1.2
DRV2_COMPN1  (via drill 0.33 pad 0.33)
  Top 0.152: IC5.13 10.37,55.73 v10.26,55.63 | TR7-1.3 6.84,62.74 ILIM2.TP 5.54,62.15 v5.54,61.52
  Bottom 0.152: v10.26,55.63 6.6,55.63 6.35,55.88 6.35,60.72 v5.54,61.52
DRV2_COMPP1  (via drill 0.33 pad 0.33)
  Top 0.152: IC5.6 7.45,60.28 v7.11,59.94 7.42,59.63 IC5.7 | 7.11,54.36 v7.11,57.15 7.65,57.68 IC5.10 | 7.11,54.36 7.11,53.78 R7-1.2 | IC5.12 9.85,56.38 9.45,55.98 8.74,55.98 7.11,54.36
  Bottom 0.152: v7.11,59.94 v7.11,57.15
DRV2_CPH1
  Top 0.152: IC5.2 12.85,62.88 13.46,63.5 13.46,64.01 14.44,64.98 C7-1.2 14.61,65.15
DRV2_CPL1
  Top 0.152: IC5.1 11.97,63.53 12.74,64.3 C7-1.1
DRV2_EN1  (via drill 0.33 pad 0.33)
  Top 0.152: 20.11,62.23 R7-5.2 20.21,62.38 17.55,62.38 IC5.26 | IC5.26 | IC1.9 14.62,23.21 14.02,22.61 12.8,22.61 12.04,23.37 12.04,24.43 11.58,24.89 v11.48,24.89 | IC5.26 16.3,62.23 v15.54,62.99
  Bottom 0.152: v11.48,24.89 10.92,24.89 5.33,30.48 5.33,33.27 4.72,33.88 4.72,49.89 6.25,51.41 6.25,52.02 4.27,54 4.27,64.06 4.42,64.21 14.33,64.21 v15.54,62.99
DRV2_EN2  (via drill 0.33 pad 0.33)
  Top 0.152: v21.08,63.65 21.08,61.3 R7-4.2 19.46,60.45 19.2,60.71 17.63,60.71 IC5.24 | v9.91,21.74 10.21,21.43 IC1.15
  Bottom 0.152: v21.08,63.65 20.22,64.52 4.27,64.52 3.96,64.21 3.96,33.43 4.32,33.07 4.32,29.41 9.45,24.28 9.45,22.2 v9.91,21.74
DRV2_EN3  (via drill 0.33 pad 0.33)
  Top 0.152: IC5.22 18.34,59.63 19.05,58.93 19.85,58.93 R7-3.2 20.23,58.25 21.08,57.4 23.11,57.4 v23.37,57.66 | IC1.19 9.78,19.43 8.89,18.54 v8.74,18.54
  Bottom 0.152: v23.37,57.66 23.37,64.26 22.81,64.82 4.12,64.82 3.66,64.36 3.66,28.85 8.89,23.62 8.89,18.69 v8.74,18.54
DRV2_IN1  (via drill 0.33 pad 0.15, 0.33 pad 0.33)
  Top 0.152: IC1.8 15.12,25.74 15.85,26.47 18.24,26.47 19.1,25.6 v21.84,25.6 | v19.66,63.75 18.79,62.88 IC5.27
  Bottom 0.152: v19.66,63.75 19.96,63.45 19.96,55.37 22.25,53.09 22.25,50.14 24.38,48.01 24.38,42.42 21.34,39.37 21.34,38.3 21.49,38.15 21.49,35.56 21.72,35.33 21.72,32.74 21.18,32.21 21.18,28.85 22.48,27.56 22.48,26.49 21.84,25.86 v21.84,25.6
DRV2_IN2  (via drill 0.33 pad 0.33)
  Top 0.152: IC1.12 13.12,25.44 14.76,27.08 19.02,27.08 19.43,26.67 21.51,26.67 v21.77,26.92 | IC5.25 v18.91,61.58 v18.92,61.59
  Bottom 0.152: v21.77,26.92 21.77,27.74 20.88,28.63 20.88,32.36 21.39,32.87 21.39,35.2 21.18,35.41 21.18,37.85 21.03,38 21.03,39.52 24.08,42.57 24.08,47.83 21.95,49.96 21.95,52.78 18.92,55.8 v18.92,61.59
DRV2_IN3  (via drill 0.33 pad 0.33)
  Top 0.152: IC1.18 9.52,19.93 8.89,19.3 v7.87,19.3 | IC5.23 18.71,60.28 19.56,59.44 23.88,59.44 v24.13,59.69
  Bottom 0.152: v7.87,19.3 7.87,23.37 3.3,27.94 3.3,64.52 3.91,65.13 23.27,65.13 24.13,64.26 v24.13,59.69
DRV2_OUT1
  Top 0.152: M2.1 1.68,60.55 6.1,60.55 6.48,60.93 IC5.5
DRV2_OUT2
  Top 0.152: IC5.8 1.83,58.98 M2.2
DRV2_OUT3
  Top 0.152: IC5.9 3.72,58.33 M2.3
DRV2_VCP1
  Top 0.152: IC5.3 10.92,62.23 10.16,62.99 10.16,63.79 C7-2.1
DRV3_3V2
  Top 0.152: IC6.15 13.75,42.13 13.02,41.4 10.92,41.4 10.51,40.99 TR8-1.2
DRV3_COMPN2  (via drill 0.33 pad 0.33)
  Top 0.152: IC6.13 10.37,42.78 v10.26,42.67 | TR8-1.3 7.1,49.53 6.76,49.53 | 6.76,49.53 ILIM3.TP | 6.76,49.53 v5.54,48.31
  Bottom 0.152: v5.54,48.31 6.35,47.5 6.35,43.18 6.86,42.67 v10.26,42.67
DRV3_COMPP2  (via drill 0.33 pad 0.33)
  Top 0.152: 7.11,42.42 7.11,40.83 R8-1.2 | IC6.6 7.45,47.33 v7.11,46.99 7.42,46.68 IC6.7 | 7.11,42.42 v7.11,43.94 7.9,44.73 IC6.10 | IC6.12 9.9,43.43 9.4,42.93 7.62,42.93 7.11,42.42
  Bottom 0.152: v7.11,46.99 v7.11,43.94
DRV3_CPH2
  Top 0.152: IC6.2 12.85,49.93 12.85,52.36 C8-1.2
DRV3_CPL2
  Top 0.152: IC6.1 12.45,51.22 12.45,52.31 C8-1.1
DRV3_EN1  (via drill 0.33 pad 0.33)
  Top 0.152: 11.09,22.43 IC1.13 10.71,22.43 v10.16,22.99 | R8-5.2 20.11,49.28 IC6.26 15.9,49.28 14.4,50.77 14.4,53.47 13.97,53.9 11.15,53.9 10.85,53.59 10.85,52.91 10.46,52.53 8.56,52.53 8.28,52.25 6.02,52.25 v5.33,51.56
  Bottom 0.152: v5.33,51.56 4.42,50.65 4.42,33.58 4.72,33.27 4.72,29.46 10.16,24.03 v10.16,22.99
DRV3_EN2  (via drill 0.33 pad 0.33)
  Top 0.152: IC6.24 18.57,47.98 18.8,47.75 19.98,47.75 R8-4.2 20.32,47.5 20.32,47.09 21.03,46.38 22.71,46.38 23.52,45.57 23.52,44.96 v22.91,44.2 | IC1.44 21.53,20.43 21.95,20.01 22.68,20.01 v22.76,20.09
  Bottom 0.152: v22.91,44.2 22.91,42.32 20.42,39.83 20.42,37.69 20.57,37.54 20.57,35.1 20.78,34.9 20.78,33.17 20.27,32.66 20.27,28.24 20.73,27.79 20.73,25.37 21.41,24.69 21.41,24.54 21.82,24.13 23.11,24.13 23.62,23.62 23.62,20.95 v22.76,20.09
DRV3_EN3  (via drill 0.33 pad 0.33)
  Top 0.152: IC6.22 18.09,46.68 18.85,45.92 19.25,45.92 19.71,46.38 20.57,46.38 21.69,45.26 R8-3.2 | 21.87,45.39 R8-3.2 | v21.84,43.43 21.96,43.55 R8-3.2 | 21.57,45.39 R8-3.2 | IC1.46 22.86,21.43 v22.91,21.39
  Bottom 0.152: v21.84,43.43 22.1,43.18 22.1,41.96 20.12,39.98 20.12,37.39 20.27,37.24 20.27,34.87 20.47,34.67 20.47,33.38 19.91,32.82 19.91,27.99 20.42,27.48 20.42,25.25 21.11,24.56 21.11,24.16 21.67,23.6 22.25,23.6 22.91,22.94 v22.91,21.39
DRV3_IN1  (via drill 0.33 pad 0.33)
  Top 0.152: IC1.21 13.1,18.43 13.46,18.8 15.7,18.8 15.85,18.95 16.97,18.95 17.86,18.06 v18.57,18.06 | IC6.27 18.94,49.93 19.56,50.55 20.32,50.55 v21.08,51.31
  Bottom 0.152: v21.08,51.31 18.14,48.36 18.14,43.08 19.3,41.91 19.3,38.61 17.78,37.08 17.53,37.08 16.76,36.32 16.76,29.77 17.68,28.85 17.68,27.48 18.9,26.26 18.9,25.04 18.54,24.69 18.54,23.44 20.42,21.56 20.42,18.9 20.07,18.54 19.05,18.54 v18.57,18.06
DRV3_IN2  (via drill 0.33 pad 0.33)
  Top 0.152: IC1.43 21.59,19.93 v22.17,19.35 | IC6.25 18.68,48.63 18.92,48.39 20.85,48.39 21.03,48.21 21.03,46.99 21.34,46.68 22.78,46.68 v23.29,47.19
  Bottom 0.152: v23.29,47.19 23.77,46.71 23.77,43.79 23.32,43.33 23.32,42.27 20.73,39.67 20.73,37.85 20.88,37.69 20.88,35.25 21.08,35.05 21.08,33.02 20.57,32.51 20.57,28.47 21.03,28.02 21.03,25.5 21.72,24.82 21.72,24.71 22,24.43 23.32,24.43 23.93,23.82 23.93,20.17 23.16,19.41 22.23,19.41 v22.17,19.35
DRV3_IN3  (via drill 0.33 pad 0.33)
  Top 0.152: IC6.23 18.46,47.33 v19.05,46.74 | IC1.45 21.97,20.93 v22.1,20.8
  Bottom 0.152: v19.05,46.74 19.05,44.96 21.59,42.42 21.59,41.91 19.81,40.13 19.81,37.08 19.96,36.93 19.96,34.75 20.17,34.54 20.17,33.6 19.58,33.02 19.58,32.05 19.48,31.95 19.48,27.89 20.12,27.25 20.12,25.12 20.8,24.43 20.8,23.98 21.54,23.24 22.07,23.24 22.4,22.91 22.4,22.45 22.1,22.15 v22.1,20.8
DRV3_OUT1
  Top 0.152: M3.1 2.08,47.45 5.94,47.45 6.48,47.98 IC6.5
DRV3_OUT2
  Top 0.152: IC6.8 1.58,46.03 M3.2
DRV3_OUT3
  Top 0.152: IC6.9 3.47,45.38 M3.3
DRV3_VCP2
  Top 0.152: IC6.3 10.92,49.28 10.41,49.78 10.41,50.94 C8-2.1
GND  (via drill 0.33, 0.33 pad 0.15, 0.6)
  Top 0.152: IC5.20 15.58,58.33 IC5.29 | IC1.31 16.12,13.64 16.61,13.16 | IC6.20 15.58,45.38 IC6.29 | IC1.11 13.62,23.28 | C2-4.2 14.19,1.47 USB.S1 | IC2.20 15.78,32.43 | 15.78,32.43 v15.39,32.82 | 15.78,32.43 15.58,32.43 IC2.29
  other vias: 1.83,51.41 1.68,38.3 19.51,11.48 10.67,7.21 19.84,13.06 7.47,17.42 21.64,55.83 13.87,57.51 15.39,57.51 13.87,58.72 15.39,58.72 15.39,59.94 15.39,61.16 13.87,61.16 13.87,59.94 13.87,44.55 15.39,44.55 13.87,45.77 15.39,45.77 15.39,46.99 15.39,48.21 13.87,48.21 13.87,46.99 13.87,31.6 15.39,31.6 13.87,32.82 15.39,34.04 15.39,35.26 13.87,35.26 13.87,34.04 5.33,56.59 9.02,50.14 14.94,38.61 15.54,5.69
  pour Bottom: 25.4,0 0,0 0,66.04 25.4,66.04
  pour Top: 25.4,0 0,0 0,66.04 25.4,66.04
ISP_01  (via drill 0.33, 0.33 pad 0.33)
  Top 0.152: IC1.24 14.9,16.93 15.49,17.53 16.15,17.53 v16.51,17.88 | IC1.5 16.62,24.84 16.9,25.12 17.14,25.12 17.73,25.7 v17.83,25.7 18.36,25.7 18.87,25.2 20.16,25.2 20.82,24.53 | 21.05,23.99 R5-2.1 | 21.03,23.98 R5-2.1 | v22.84,25.81 22.84,25.48 22.33,24.97 21.26,24.97 20.82,24.53 | 20.82,24.53 R5-2.1
  Bottom 0.152: v16.51,17.88 16.51,19.81 16.15,20.17 16.15,24.64 16.36,24.84 16.97,24.84 v17.83,25.7 17.25,25.12 | ISP.1 23.77,50.44 23.77,49.12 24.69,48.21 24.69,42.27 21.64,39.22 21.64,38.46 21.79,38.3 21.79,35.71 22.02,35.48 22.02,32.59 21.64,32.21 21.64,28.88 23.55,26.97 22.84,26.26 v22.84,25.81
LED1
  Top 0.152: L029.C 22.43,15.74 R5-1.2
LED2
  Top 0.152: LED3-1.C 1.05,8.99 R3-1.2
MCU_RXD  (via drill 0.33 pad 0.33)
  Top 0.152: v9.91,18.29 10.26,17.93 IC1.22 | IC3.20 16.95,12.38 16.26,11.68 14.99,11.68 13.36,13.31 v13.21,13.31
  Bottom 0.152: v9.91,18.29 9.4,17.78 9.4,13.72 9.81,13.31 v13.21,13.31
MCU_TXD  (via drill 0.33 pad 0.33)
  Top 0.152: IC3.4 13.65,10.48 13.97,10.16 v13.97,8.89 | IC1.23 9.81,17.43 8.89,16.51 v8.64,16.51
  Bottom 0.152: v13.97,8.89 12.95,8.89 8.64,13.21 v8.64,16.51
PIO0_22
  Top 0.152: 20.32,16.85 20.27,16.9 IC1.37 20.96,16.93 21.49,16.41 21.49,13.94 21.77,13.66 23.27,13.66 GPIO.1
PIO0_23
  Top 0.152: IC1.38 22.41,17.43 24.13,15.72 GPIO.2
PIO0_28
  Top 0.152: IC1.47 22.34,21.93 22.55,22.15 23.32,22.15 23.62,21.84 23.62,18.39 GPIO.3
PIO0_29  (via drill 0.33 pad 0.33)
  Top 0.152: IC1.48 21.55,22.43 v21.74,22.63 | 21.07,15.9 L029.A 20.46,16.2 v19.79,16.2
  Bottom 0.152: v21.74,22.63 21.34,22.22 21.34,17.27 20.27,16.2 v19.79,16.2 20.12,16.2
QEI_IDX  (via drill 0.33 pad 0.33)
  Top 0.152: ENC.4 3.3,19.81 3.3,21.08 3.56,21.34 7.26,21.34 7.47,21.54 7.47,22.36 R5-3.1 9.23,24.13 10.77,24.13 v11.2,23.7 | IC1.28 14.62,16.11 14.35,16.38 12.83,16.38 v12.19,15.75
  Bottom 0.152: v12.19,15.75 11.68,16.26 11.68,23.22 v11.2,23.7
QEI_PHA  (via drill 0.33 pad 0.33)
  Top 0.152: R5-7.1 6.48,23.24 | 6.48,23.24 5.59,24.13 2.54,24.13 ENC.2 | v13.97,17.78 15.29,17.78 15.7,18.19 15.7,18.34 16,18.64 16.82,18.64 17.4,18.06 17.4,17.75 18.62,16.53 IC1.36 | 6.48,23.24 7.52,24.28 8.69,24.28 10.06,25.65 11.58,25.65 12.42,26.49 v12.42,27.23
  Bottom 0.152: 14.17,17.98 v13.97,17.78 14.33,18.14 14.33,22.91 14.02,23.22 14.02,26.24 13.03,27.23 v12.42,27.23
QEI_PHB  (via drill 0.33 pad 0.33)
  Top 0.152: ENC.3 3.14,22.19 R5-5.1 v4.57,23.37 | IC1.35 18.12,14.26 18.29,14.1 18.92,14.1 19.05,14.22 19.05,17.12 19.28,17.35 19.28,18.44 18.95,18.77 17.6,18.77 17.12,19.25 13.92,19.25 v13.41,19.76 | v11.12,26.42 9.4,26.42 8.64,25.65 8.64,24.89 8.33,24.59 4.88,24.59 v4.57,24.89
  Bottom 0.152: v4.57,23.37 v4.57,24.89 | v11.12,26.42 12.65,26.42 13.11,25.96 13.11,23.52 14.02,22.61 14.02,20.37 v13.41,19.76
REG_BYPASS
  Top 0.152: C3-2.1 6.48,5.21 7.11,5.84 7.86,5.84 IC4.4
REG_VIN  (via drill 0.33 pad 0.33)
  Top 0.152: D3-2.C 9.4,1.27 | 9.4,1.27 D3-1.C | IC4.3 9.33,3.56 | 9.33,3.56 9.33,1.34 9.4,1.27 | C3-1.1 6.6,2.92 | 6.6,2.92 8.7,2.92 9.33,3.56 | 6.6,2.92 5.46,4.06 3.56,4.06 3.17,4.44 3.17,5.97 1.91,7.24 v1.91,11.94 | 6.6,2.92 7.43,3.75 IC4.1
  Bottom 0.152: v1.91,11.94 3.3,13.33 3.3,23.88 1.78,25.4 ENC.1
SWCLK  (via drill 0.33 pad 0.33)
  Top 0.152: IC1.29 15.12,16.14 16,17.02 17.02,17.02 v17.22,16.81
  Bottom 0.152: v17.22,16.81 17.32,16.81 19.91,14.22 21.49,14.22 22.71,15.44 22.71,18.49 24.23,20.01 24.23,26.72 21.95,29.01 21.95,32.05 22.4,32.51 22.4,33.83 SWD.3
SWDIO  (via drill 0.33 pad 0.33)
  Top 0.152: IC1.33 17.12,14.05 v16.94,13.87
  Bottom 0.152: SWD.2 22.35,31.24 22.35,29.21 24.54,27.03 24.54,19.86 23.01,18.34 23.01,15.14 21.74,13.87 v16.94,13.87
USBDM
  Top 0.152: IC3.12 18.99,7.3 19.3,7.62 19.3,8.13 20.28,9.1 R2-1.2 21.04,8.89 C2-1.1
USBDP
  Top 0.152: IC3.11 19.11,6.67 19.81,7.37 19.81,7.87 20.19,8.25 21.59,8.25 22.38,7.47 R2-2.2 C2-2.1
VCCIO3V3  (via drill 0.33 pad 0.33)
  Top 0.152: IC3.13 IC3.14 18.86,8.57 19.81,9.52 v19.81,10.41 | C2-5.1 13.34,5.21 15.75,7.62 15.75,9.4 v16.51,10.16 15.56,11.11 IC3.3
  Bottom 0.152: v19.81,10.41 19.56,10.16 v16.51,10.16
XTALIN
  Top 0.152: C1-7.1 10.72,9.24 Q1.1 | Q1.1 11.18,10.95 | IC1.26 13.62,14.39 13.4,14.16 12.89,14.16 11.43,12.7 11.43,11.68 10.72,10.98 Q1.1
XTALOUT
  Top 0.152: C1-6.1 6.95,13.52 Q1.3 9.76,13.46 11.33,13.46 IC1.25

### Text on the board
tPlace: 028 / 023 / 022
bPlace: Gimbal controller - rev1 | dlofstrom